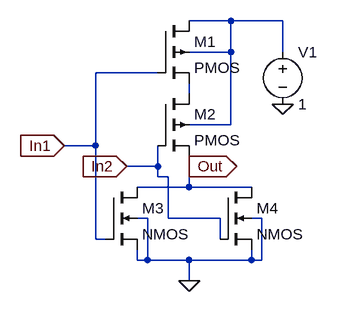
[diagram p0: schematic Nor2.asc]
Nor2.asc, the LTspice schematic file:
Version 4
SHEET 1 880 680
WIRE 288 48 224 48
WIRE 368 48 288 48
WIRE 288 96 288 48
WIRE 288 96 224 96
WIRE 368 96 368 48
WIRE 176 128 80 128
WIRE 224 160 224 144
WIRE 288 208 288 96
WIRE 288 208 224 208
WIRE 80 240 80 128
WIRE 80 240 32 240
WIRE 176 272 176 240
WIRE 176 272 128 272
WIRE 224 272 224 256
WIRE 176 288 176 272
WIRE 192 288 176 288
WIRE 224 304 224 272
WIRE 224 304 144 304
WIRE 320 304 224 304
WIRE 160 352 144 352
WIRE 192 352 192 288
WIRE 272 352 192 352
WIRE 336 352 320 352
WIRE 80 384 80 240
WIRE 96 384 80 384
WIRE 272 384 272 352
WIRE 144 416 144 400
WIRE 160 416 160 352
WIRE 160 416 144 416
WIRE 224 416 160 416
WIRE 320 416 320 400
WIRE 320 416 224 416
WIRE 336 416 336 352
WIRE 336 416 320 416
WIRE 224 448 224 416
FLAG 224 448 0
FLAG 368 176 0
FLAG 32 240 In1
IOPIN 32 240 In
FLAG 224 272 Out
IOPIN 224 272 Out
FLAG 128 272 In2
IOPIN 128 272 In
SYMBOL pmos4 176 48 R0
SYMATTR InstName M1
SYMATTR Value2 l=130n w=4u
SYMBOL pmos4 176 160 R0
SYMATTR InstName M2
SYMATTR Value2 l=130n w=4u
SYMBOL nmos4 96 304 R0
SYMATTR InstName M3
SYMATTR Value2 l=130n w=1u
SYMBOL nmos4 272 304 R0
SYMATTR InstName M4
SYMATTR Value2 l=130n w=1u
SYMBOL voltage 368 80 R0
WINDOW 123 0 0 Left 0
WINDOW 39 0 0 Left 0
SYMATTR InstName V1
SYMATTR Value 1

The netlist it stands for:
* Nor2.asc
M1 N001 In1 N002 N001 PMOS l=130n w=4u
M2 N002 In2 Out N001 PMOS l=130n w=4u
M3 Out In1 0 0 NMOS l=130n w=1u
M4 Out In2 0 0 NMOS l=130n w=1u
V1 N001 0 1
.model NMOS NMOS
.model PMOS PMOS
.lib standard.mos
.backanno
.end